# EAGLE design geekworm-monitor (EAGLE 9.0.1)
PROJECT_AUTHOR: Xose Perez <xose.perez@gmail.com>; PROJECT_LICENSE: CC-SA-BY-NC 4.0; PROJECT_NAME: GEEKWORM UPS HELPER; PROJECT_VERSION: 0.1.20180206
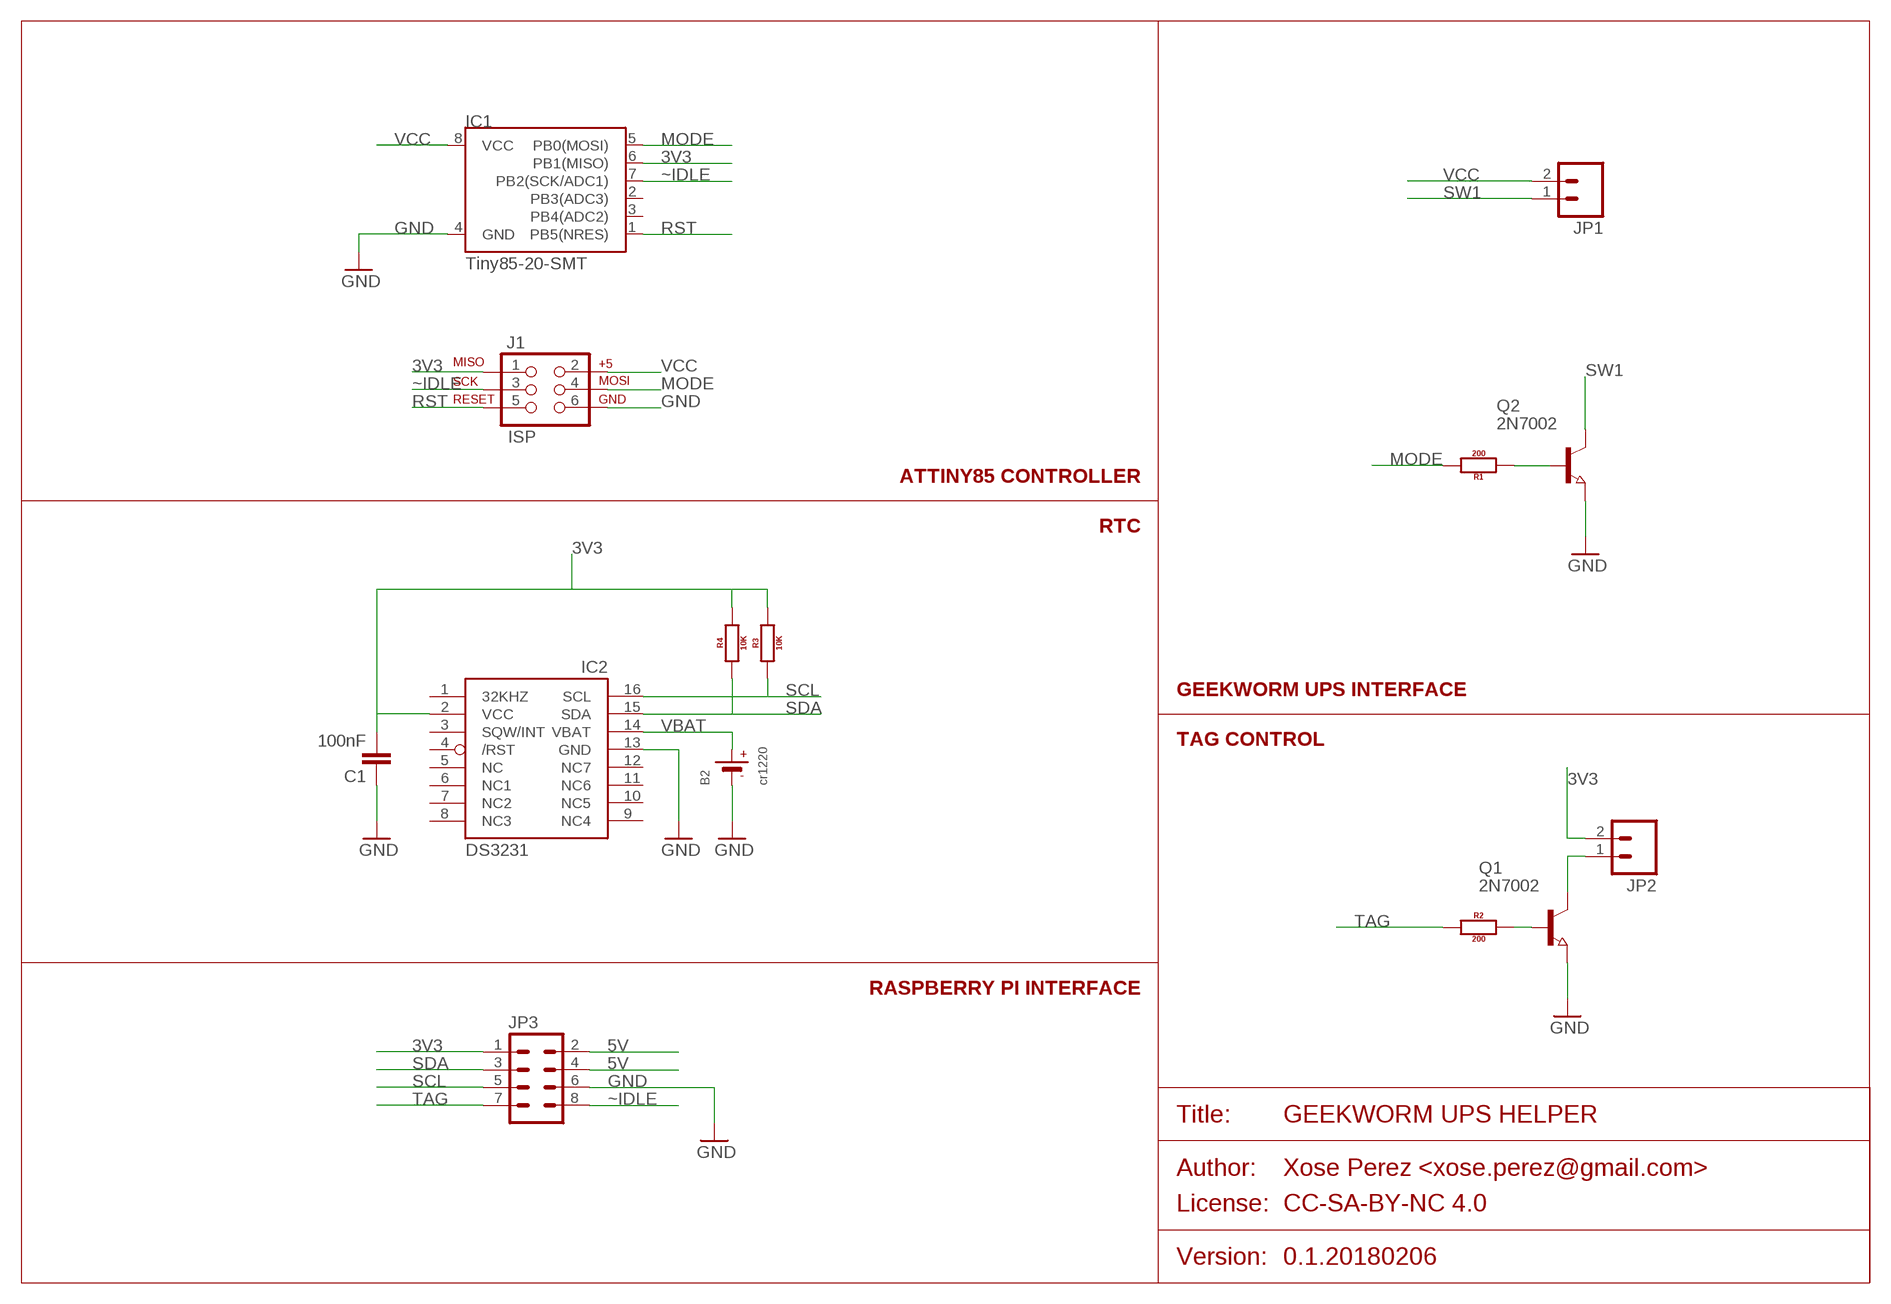
[diagram p0: schematic, sheet 1]

## Parts
B2  cr1220  MICROBUILDER_BATTERYCR1220_2  [MICROBUILDER_CR1220-2]
C1  100nF  C-EU0805  [0805]
IC1  Tiny85-20-SMT  ATTINY45TINY85-20-SMT  [SO08-EIAJ]
IC2  DS3231/SO  [SO16W]
J1  ISP  AVR_SPIEDGE  [2X3EDGE]
JP1  M02-JST-2MM-SMT  [JST-2-SMD]
JP2  M02-JST-2MM-SMT  [JST-2-SMD]
JP3  M04X2  [2X4]
Q1  2N7002  NPN-TRANSISTOR_SOT23  [SOT23]
Q2  2N7002  NPN-TRANSISTOR_SOT23  [SOT23]
R1  200  RESISTOR0805  [0805]
R2  200  RESISTOR0805  [0805]
R3  10K  RESISTOR0805  [0805]
R4  10K  RESISTOR0805  [0805]

## Nets
3V3: C1.2 IC1.6(PB1(MISO)) IC2.2(VCC) J1.1 JP2.2 JP3.1 R3.2 R4.2
5V: JP3.2 JP3.4
GND: B2.- C1.1 IC1.4(GND) IC2.13(GND) J1.6 JP3.6 Q1.2(E) Q2.2(E)
MODE: IC1.5(PB0(MOSI)) J1.4 R1.2
N$1: Q1.1(B) R2.2
N$2: Q2.1(B) R1.1
N$3: JP2.1 Q1.3(C)
RST: IC1.1(PB5(NRES)) J1.5
SCL: IC2.16(SCL) JP3.5 R3.1
SDA: IC2.15(SDA) JP3.3 R4.1
SW1: JP1.1 Q2.3(C)
TAG: JP3.7 R2.1
VBAT: B2.+ IC2.14(VBAT)
VCC: IC1.8(VCC) J1.2 JP1.2
~IDLE: IC1.7(PB2(SCK/ADC1)) J1.3 JP3.8
Unconnected: IC1.2(PB3(ADC3)) IC1.3(PB4(ADC2)) IC2.1(32KHZ) IC2.3(SQW/INT) IC2.4(/RST) IC2.5(NC) IC2.6(NC1) IC2.7(NC2) IC2.8(NC3) IC2.9(NC4) IC2.10(NC5) IC2.11(NC6) IC2.12(NC7)

## Notes on the sheet
- ATTINY85 CONTROLLER
- RTC
- GEEKWORM UPS INTERFACE
- TAG CONTROL
- RASPBERRY PI INTERFACE

## Library data of the parts
B2 = geekworm-monitor:MICROBUILDER_BATTERY: CR1220 SMT - Digikey: 3001K-ND CD2032 BAT-HLD-001 - Digikey: BAT-HLD-001-ND
C1 = xose:C-EU: CAPACITOR, European symbol
IC1 = SparkFun-DigitalIC:ATTINY45: Atmel 8-pin 2/4/8kB flash uC; PROD_ID: IC-09092
IC2 = adafruit:DS3231
J1 = xose:AVR_SPI: AVR ISP 6 Pin This is the reduced ISP connector for AVR programming. Common on Arduino. This footprint will take up less PCB space and can be used with a 10-pin to 6-pin adapter such as SKU: BOB-08508
JP1 JP2 = xose:M02: Standard 2-pin 0.1" header. Use with - straight break away headers ( PRT-00116) - right angle break away headers (PRT-00553) - swiss pins (PRT-00743) - machine pins (PRT-00117) - female headers (PRT-00115) Molex polarized connector foot print use with: PRT-08233 with associated crimp pins and housings. 2.54_SCREWTERM for use with PRT-10571. 3.5mm Screw Terminal footprints for PRT-08084 5mm Screw Terminal footprints for use with PRT-08432; PROD_ID: CONN-11443
JP3 = xose:M04X2: .1" header, two rows of four.
Q1 Q2 = xose:NPN-TRANSISTOR_: NPN TRANSISTOR
R1-R4 = xose:RESISTOR: Generic EU resistor symbol

## Board
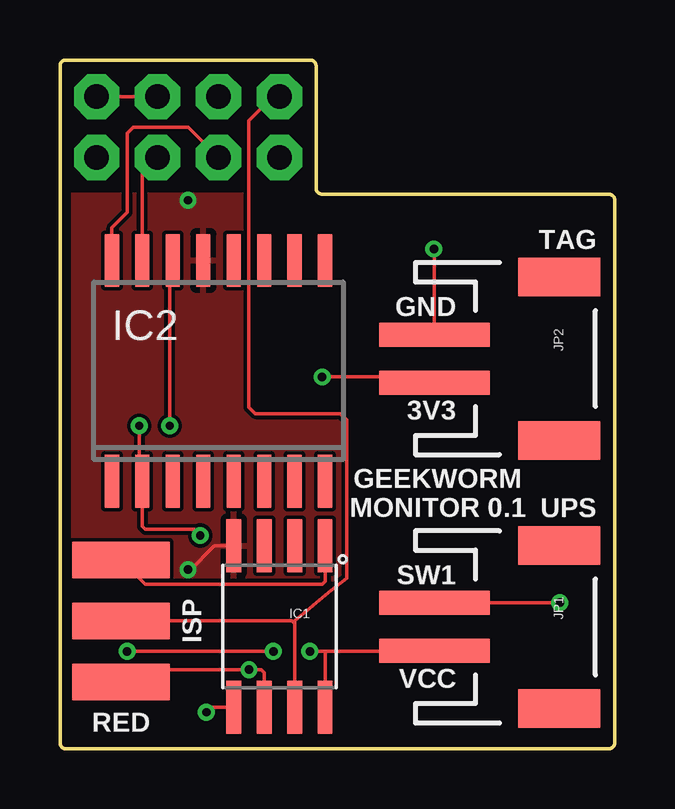
[diagram p1: board, top side]
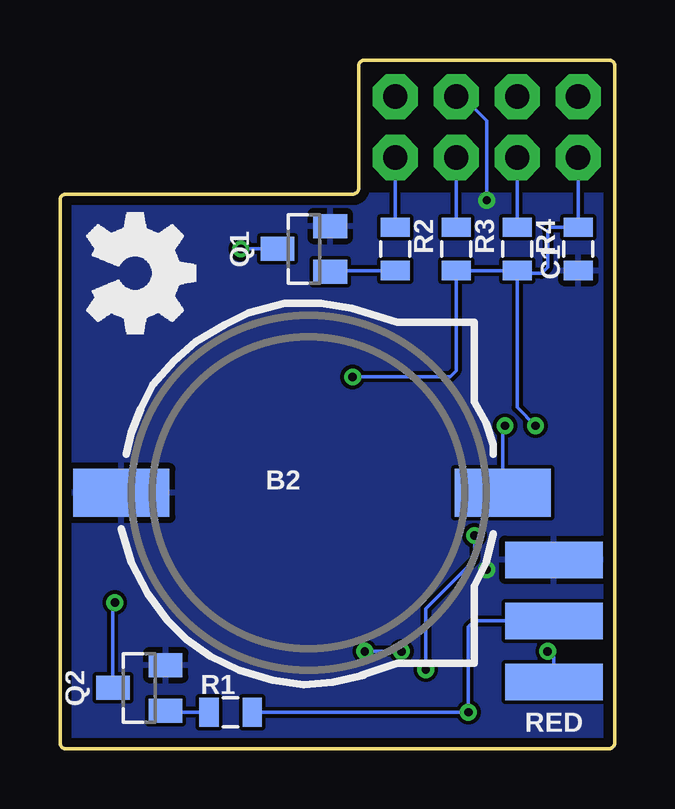
[diagram p2: board, bottom side, seen from below]

Size 23.11 x 28.7 mm. Coordinates in mm from the lower left corner, seen from the top.
Outline: 0,0.25 0,28.45 arc-90 0.25,28.7 10.41,28.7 arc-90 10.67,28.45 10.67,23.37 arc90 10.92,23.11 22.86,23.11 arc-90 23.11,22.86 23.11,0.25 arc-90 22.86,0 0.25,0 arc-90 0,0.25
Copper layers (1*16): Top 0.0356mm / dielectric 1.5011mm / Bottom 0.0356mm
Design rules "oshpark-2layer": minimum track width 6mil, minimum drill 13mil, track to track 6mil, track to pad 6mil, pad to pad 6mil, via to via 6mil, smd to smd 6mil, copper to edge 15mil, drill to drill 6mil, minimum pad ring 7mil, minimum via ring 7mil, stop-mask expansion 2.5mil, vias tented up to drill 0mil, thermal gap 10mil

### Footprints (pad centres in the part's own frame; a part is rotated, then mirrored left to right if it is on the bottom)
MICROBUILDER_CR1220-2 = smd 4 x 2: + 8.29,0; - -7.6,0
0805 = smd 0.8 x 1.2: 1 -0.9,0; 2 0.9,0
SO08-EIAJ = smd 0.61 x 2.21: 1 -1.905,-3.378; 2 -0.635,-3.378; 3 0.635,-3.378; 4 1.905,-3.378; 5 1.905,3.353; 6 0.635,3.353; 7 -0.635,3.353; 8 -1.905,3.353
SO16W = smd 0.6 x 2.2: 1 -4.445,-4.6; 2 -3.175,-4.6; 3 -1.905,-4.6; 4 -0.635,-4.6; 5 0.635,-4.6; 6 1.905,-4.6; 7 3.175,-4.6; 8 4.445,-4.6; 9 4.445,4.6; 10 3.175,4.6; 11 1.905,4.6; 12 0.635,4.6; 13 -0.635,4.6; 14 -1.905,4.6; 15 -3.175,4.6; 16 -4.445,4.6
2X3EDGE = smd 1.524 x 4.064: 1 2.54,0; 3 0,0; 5 -2.54,0 | smd 1.524 x 4.064 bottom: 2 2.54,0; 4 0,0; 6 -2.54,0
JST-2-SMD = smd 1 x 4.6: 1 -1,-3.7; 2 1,-3.7 | smd 1.6 x 3.4: NC1 -3.4,1.5; NC2 3.4,1.5
2X4 = drill 1.016 pad 1.88 octagon: 1 -3.81,-1.27; 2 -3.81,1.27; 3 -1.27,-1.27; 4 -1.27,1.27; 5 1.27,-1.27; 6 1.27,1.27; 7 3.81,-1.27; 8 3.81,1.27
SOT23 = smd 1 x 1.4: 1 -0.95,-1.1; 2 0.95,-1.1; 3 0,1.1

### Placement (x,y rotation side)
B2  12.95,10.67 0 bottom
C1  1.52,20.83 90 bottom
IC1  9.14,5.08 180 top
IC2  6.6,15.75 0 top
J1  2.54,5.33 270 top
JP1  19.3,5.08 270 top
JP2  19.3,16.26 270 top
JP3  5.33,25.91 0 top
Q1  12.95,20.83 90 bottom
Q2  19.81,2.54 90 bottom
R1  16,1.52 0 bottom
R2  9.14,20.83 270 bottom
R3  6.6,20.83 270 bottom
R4  4.06,20.83 270 bottom

### Tracks (layer width: path | path; a pad name or v marks a point on that pad's centre or on a via)
3V3  (via drill 0.35)
  Top 0.152: IC1.6 8.51,3.17 8.38,3.3 v7.87,3.3 3.05,3.3 J1.1 | 3.43,10.92 IC2.2 | 3.43,10.92 3.43,9.27 3.56,9.14 5.59,9.14 v5.84,8.89 | v3.3,13.46 3.3,11.05 3.43,10.92 | v10.92,15.49 15.37,15.49 JP2.2
  Bottom 0.152: R4.2 R3.2 6.6,15.75 6.86,15.49 v10.92,15.49 | v5.84,8.89 5.84,7.87 7.87,5.84 v7.87,3.3 | R4.2 4.06,14.22 v3.3,13.46 | JP3.1 C1.2 2.66,21.73 2.79,21.59 2.79,20.07 3.05,19.81 3.95,19.81 R4.2
5V
  Top 0.152: JP3.2 JP3.4
GND  (via drill 0.35)
  Top 0.152: IC1.4 6.43,8.46 5.33,7.37 v5.33,7.46
  Bottom 0.152: JP3.6 6.35,27.18 5.33,26.16 v5.33,22.86
  pour Top: 23.11,23.11 23.11,-0.25 -0.25,-0.25 -0.25,23.11
  pour Bottom: 23.37,23.11 23.37,-0.51 -0.51,-0.51 -0.51,23.11
MODE  (via drill 0.35)
  Top 0.152: IC1.5 6.3,1.73 v6.1,1.52
  Bottom 0.152: R1.2 v6.1,1.52 6.1,5.08 5.84,5.33 J1.4
N$1
  Bottom 0.152: R2.2 11.8,19.93 Q1.1
N$2
  Bottom 0.152: R1.1 18.65,1.52 Q2.1
N$3  (via drill 0.35)
  Top 0.152: JP2.1 15.6,20.8 v15.58,20.83
  Bottom 0.152: Q1.3 v15.58,20.83
RST
  Top 0.152: IC1.1 11.05,6.98 10.92,6.86 3.56,6.86 J1.5
SCL
  Top 0.152: IC2.16 2.16,21.72 2.79,22.35 2.79,25.65 3.05,25.91 5.33,25.91 JP3.5
  Bottom 0.152: R3.1 JP3.5
SDA
  Top 0.152: IC2.15 3.43,24 JP3.3
  Bottom 0.152: R4.1 JP3.3
SW1  (via drill 0.35)
  Top 0.152: v20.83,6.1 15.62,6.1 JP1.1
  Bottom 0.152: Q2.3 20.91,6.01 v20.83,6.1
TAG
  Bottom 0.152: R2.1 JP3.7
VBAT  (via drill 0.35)
  Top 0.152: v4.57,13.46 4.57,20.22 IC2.14
  Bottom 0.152: B2.+ 4.66,13.37 v4.57,13.46
VCC  (via drill 0.35)
  Top 0.152: IC1.8 11.05,4.06 | v2.79,4.06 v8.89,4.06 | v10.41,4.06 11.05,4.06 | 11.05,4.06 15.59,4.06 JP1.2
  Bottom 0.152: J1.2 2.54,3.81 v2.79,4.06 | v8.89,4.06 v10.41,4.06
~IDLE
  Top 0.152: JP3.8 8.89,27.18 7.87,26.16 7.87,14.22 8.13,13.97 11.68,13.97 11.94,13.72 11.94,7.11 11.3,6.6 9.78,5.33 9.78,5.21 | 9.78,5.21 IC1.7 | 9.78,5.21 9.65,5.33 J1.3

### Text on the board
tPlace: TAG | GND | 3V3 | GEEKWORM / MONITOR 0.1 | UPS | SW1 | VCC